# EAGLE design Multimeter1.1 (EAGLE 7.1.0)
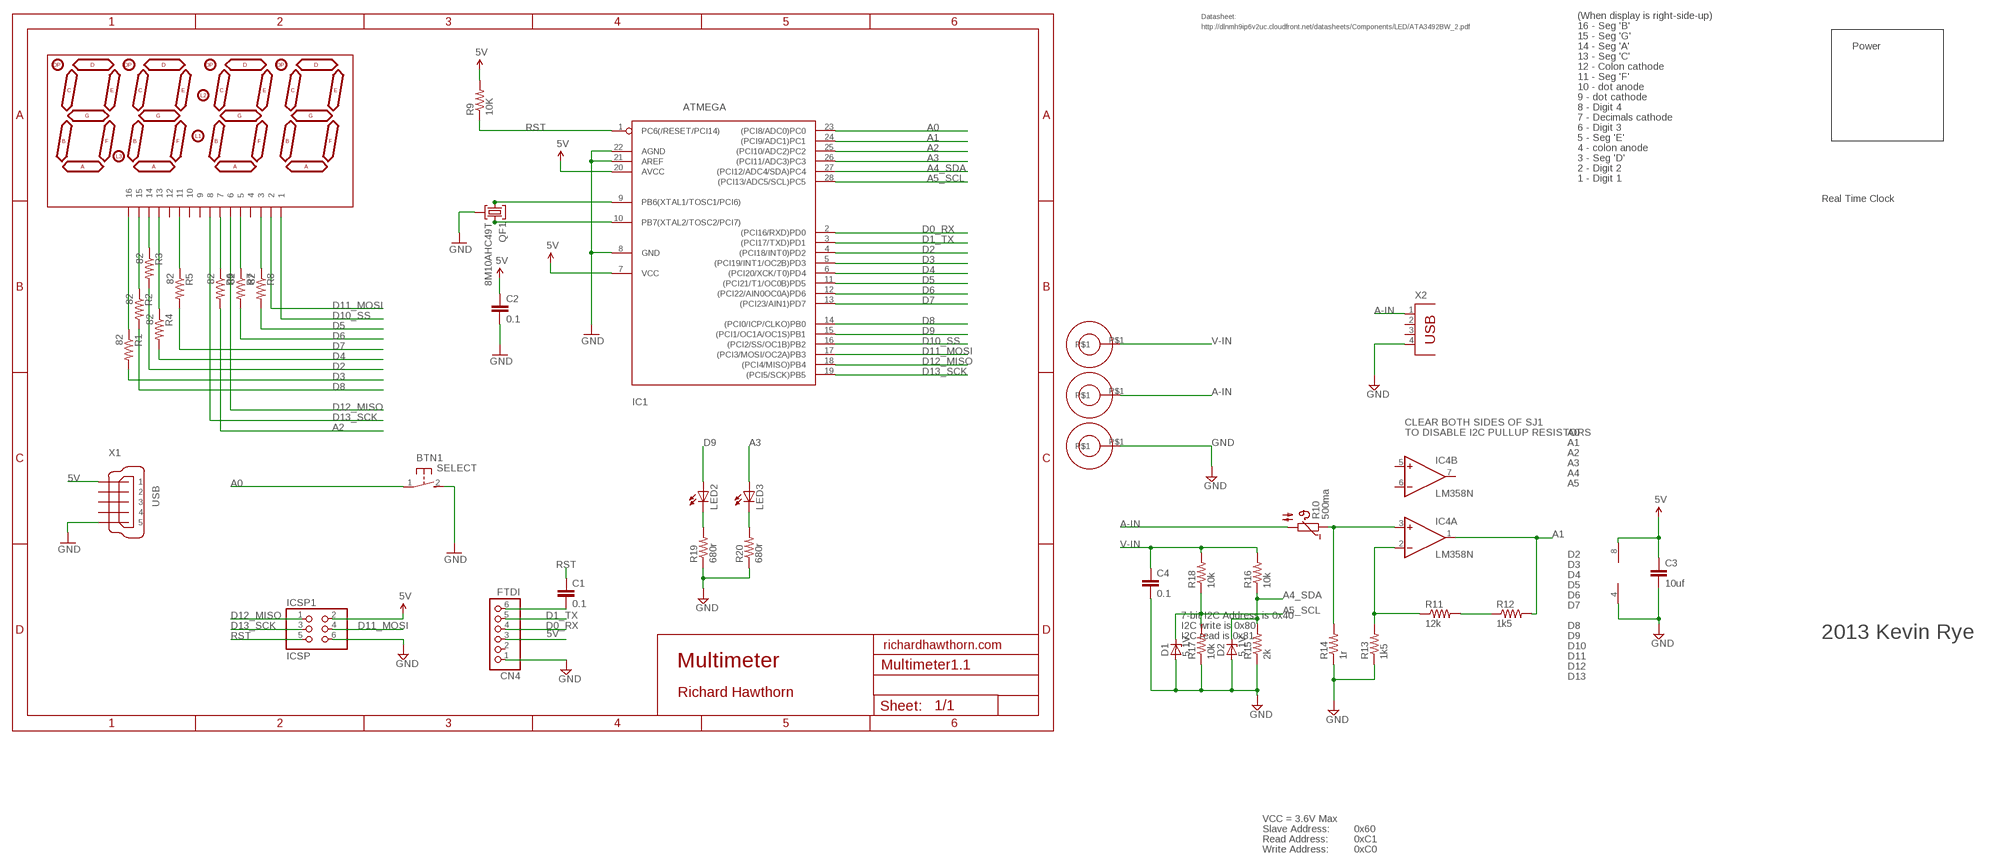
[diagram p0: schematic, sheet 1]

## Parts
BTN1  SELECT  DTS-3  [DTS-3]
C1  0.1  CAPPTH2  [CAP-PTH-SMALL2]
C2  0.1  CAPPTH2  [CAP-PTH-SMALL2]
C3  10uf  CAPPTH2  [CAP-PTH-SMALL2]
C4  0.1  CAPPTH2  [CAP-PTH-SMALL2]
CN4  FTDI  PINHD-1X6  [1X06]
D1  5.1V  BZX90  [DO34Z7]
D2  5.1V  BZX90  [DO34Z7]
IC1  ATMEGA  ATMEGA168PROUND  [DIL28-3-ROUND]
IC4  LM358N  [DIL08]
ICSP1  ICSP  PINHD-2X3  [2X03]
LED1  7SEG-4DIGIT  [SPARKFUN_7-SEGMENT-4DIGIT]
LED2  LED5MM  [LED5MM]
LED3  LED5MM  [LED5MM]
QF1  8M10AHC49T  [HC49U]
R1  82  R-US_0204/7  [0204/7]
R2  82  R-US_0204/7  [0204/7]
R3  82  R-US_0204/7  [0204/7]
R4  82  R-US_0204/7  [0204/7]
R5  82  R-US_0204/7  [0204/7]
R6  82  R-US_0204/7  [0204/7]
R7  82  R-US_0204/7  [0204/7]
R8  82  R-US_0204/7  [0204/7]
R9  10K  R-US_0204/7  [0204/7]
R10  500ma  B57164  [B57164]
R11  12k  R-US_0204/7  [0204/7]
R12  1k5  R-US_0204/7  [0204/7]
R13  1k5  R-US_0204/7  [0204/7]
R14  1r  R-US_0204/7  [0204/7]
R15  2k  R-US_0204/7  [0204/7]
R16  10k  R-US_0204/7  [0204/7]
R17  10k  R-US_0204/7  [0204/7]
R18  10k  R-US_0204/7  [0204/7]
R19  680r  R-US_0204/7  [0204/7]
R20  680r  R-US_0204/7  [0204/7]
U$1  BANANA  [BANANA]
U$5  BANANA  [BANANA]
U$6  BANANA  [BANANA]
X1  USB  MINI-USB_SHIELD5P2-32005-601  [32005-601]
X2  PN87520  [PN87520]

## Nets
5V [power]: C2.1 C3.1 CN4.3 IC1.7(VCC) IC1.20(AVCC) IC4.8(P:V+) ICSP1.2 R9.2 X1.1
A0: BTN1.1 IC1.23((PCI8/ADC0)PC0)
A1: IC1.24((PCI9/ADC1)PC1) IC4.1(A:OUT) R12.2
A2: IC1.25((PCI10/ADC2)PC2) R6.2
A3: IC1.26((PCI11/ADC3)PC3) LED3.A
A4_SDA: D2.C IC1.27((PCI12/ADC4/SDA)PC4) R15.2 R16.1
A5_SCL [power]: D1.C IC1.28((PCI13/ADC5/SCL)PC5) R17.2 R18.1
A-IN [power]: R10.2 U$5.P$1 X2.1
D0_RX: CN4.4 IC1.2((PCI16/RXD)PD0)
D1_TX: CN4.5 IC1.3((PCI17/TXD)PD1)
D2: IC1.4((PCI18/INT0)PD2) R3.2
D3: IC1.5((PCI19/INT1/OC2B)PD3) R1.2
D4: IC1.6((PCI20/XCK/T0)PD4) R4.2
D5: IC1.11((PCI21/T1/OC0B)PD5) R8.2
D6: IC1.12((PCI22/AIN0OC0A)PD6) R7.2
D7: IC1.13((PCI23/AIN1)PD7) R5.2
D8: IC1.14((PCI0/ICP/CLKO)PB0) R2.2
D9: IC1.15((PCI1/OC1A/OC1S)PB1) LED2.A
D10_SS: IC1.16((PCI2/SS/OC1B)PB2) LED1.1
D11_MOSI: IC1.17((PCI3/MOSI/OC2A)PB3) ICSP1.4 LED1.2
D12_MISO: IC1.18((PCI4/MISO)PB4) ICSP1.1 LED1.6
D13_SCK: IC1.19((PCI5/SCK)PB5) ICSP1.3 LED1.8
GND [power]: BTN1.2 C2.2 C3.2 C4.2 CN4.1 D1.A D2.A IC1.8(GND) IC1.21(AREF) IC1.22(AGND) IC4.4(P:V-) ICSP1.6 QF1.2 R13.1 R14.1 R15.1 R17.1 R19.1 R20.1 U$6.P$1 X1.5 X2.4
N$3: LED1.16 R1.1
N$4: IC4.2(A:-IN) R11.1 R13.2
N$5: LED1.15 R2.1
N$7: LED2.K(C) R19.2
N$8: LED3.K(C) R20.2
N$10: R11.2 R12.1
N$12: LED1.7 R6.1
N$13 [power]: IC4.3(A:+IN) R10.1 R14.2
N$16: IC1.9(PB6(XTAL1/TOSC1/PCI6)) QF1.1
N$20: C1.2 CN4.6
N$22: LED1.13 R4.1
N$24: LED1.14 R3.1
N$25: LED1.11 R5.1
N$26: IC1.10(PB7(XTAL2/TOSC2/PCI7)) QF1.3
N$29: LED1.5 R7.1
N$30: LED1.3 R8.1
RST: C1.1 IC1.1(PC6(/RESET/PCI14)) ICSP1.5 R9.1
V-IN [power]: C4.1 R16.2 R18.2 U$1.P$1
Unconnected: CN4.2 IC4.5(B:+IN) IC4.6(B:-IN) IC4.7(B:OUT) LED1.4 LED1.9 LED1.10 LED1.12 X1.2 X1.3 X1.4 X1.M1(S1) X1.M2(S2) X2.2 X2.3

## Notes on the sheet
- Datasheet: | (When display is right-side-up)
- http://dlnmh9ip6v2uc.cloudfront.net/datasheets/Components/LED/ATA3492BW_2.pdf | 16 - Seg 'B'
- 15 - Seg 'G'
- 14 - Seg 'A' | Power
- 13 - Seg 'C'
- 12 - Colon cathode
- 11 - Seg 'F'
- 10 - dot anode
- 9 - dot cathode
- 8 - Digit 4
- 7 - Decimals cathode
- 6 - Digit 3
- 5 - Seg 'E'
- 4 - colon anode
- 3 - Seg 'D'
- 2 - Digit 2
- 1 - Digit 1
- Real Time Clock
- CLEAR BOTH SIDES OF SJ1
- TO DISABLE I2C PULLUP RESISTORS | A0
- A1
- A2
- A3
- A4
- A5
- D2
- D3
- D4
- D5
- D6
- D7
- 7-bit I2C Address is 0x40
- I2C write is 0x80 | D8
- I2C read is 0x81 | D9 | 2013 Kevin Rye
- richardhawthorn.com | D10
- D11
- Multimeter | D12
- D13
- Richard Hawthorn
- VCC = 3.6V Max
- Slave Address: | 0x60
- Read Address: | 0xC1
- Write Address: | 0xC0

## Library data of the parts
BTN1 = switch-tact:DTS-3
C1-C4 = LowPowerLab:CAP: Capacitor Standard 0603 ceramic capacitor, and 0.1" leaded capacitor.
CN4 = pinhead:PINHD-1X6: PIN HEADER
D1 D2 = diode:BZX90: Z DIODE
IC1 = adafruit:ATMEGA168*P: MICROCONTROLLER 16 kBytes FLASH 1 kBytes SRAM 512 Bytes EEPROM USART 8-channel 10 bit ADC
IC4 = linear:LM358: OP AMP also LM158; LM258; LM2904 Source: http://cache.national.com/ds/LM/LM158.pdf
ICSP1 = pinhead:PINHD-2X3: PIN HEADER
LED1 = sparkfun-4digit-sseg:7SEG-4DIGIT
LED2 LED3 = led:LED: LED OSRAM: - CHIPLED LG R971, LG N971, LY N971, LG Q971, LY Q971, LO R971, LY R971 LH N974, LH R974 LS Q976, LO Q976, LY Q976 LO Q996 - Hyper CHIPLED LW Q18S LB Q993, LB Q99A, LB R99A - SideLED LS A670, LO A670, LY A670, LG A670, LP A670 LB A673, LV A673, LT A673, LW A673 LH A674 LY A675 LS A676, LA A676, LO A676, LY A676, LW A676 LS A679, LY A679, LG A679 - Hyper Micro SIDELED® LS Y876, LA Y876, LO Y876, LY Y876 LT Y87S - SmartLED LW L88C, LW L88S LB L89C, LB L89S, LG L890 LS L89K, LO L89K, LY L89K LS L896, LA L896, LO L896, LY L896 - TOPLED LS T670, LO T670, LY T670, LG T670, LP T670 LSG T670, LSP T670, LSY T670, LOP T670, LYG T670 LG T671, LOG T671, LSG T671 LB T673, LV T673, LT T673, LW T673 LH T674 LS T676, LA T676, LO T676, LY T676, LB T676, LH T676, LSB T676, LW T676 LB T67C, LV T67C, LT T67C, LS T67K, LO T67K, LY T67K, LW E67C LS E67B, LA E67B, LO E67B, LY E67B, LB E67C, LV E67C, LT E67C LW T67C LS T679, LY T679, LG T679 LS T770, LO T770, LY T770, LG T770, LP T770 LB T773, LV T773, LT T773, LW T773 LH T774 LS E675, LA E675, LY E675, LS T675 LS T776, LA T776, LO T776, LY T776, LB T776 LHGB T686 LT T68C, LB T68C - Hyper Mini TOPLED® LB M676 - Mini TOPLED Santana® LG M470 LS M47K, LO M47K, LY M47K Source: http://www.osram.convergy.de LUXEON: - LUMILED® LXK2-PW12-R00, LXK2-PW12-S00, LXK2-PW14-U00, LXK2-PW14-V00 LXK2-PM12-R00, LXK2-PM12-S00, LXK2-PM14-U00 LXK2-PE12-Q00, LXK2-PE12-R00, LXK2-PE12-S00, LXK2-PE14-T00, LXK2-PE14-U00 LXK2-PB12-K00, LXK2-PB12-L00, LXK2-PB12-M00, LXK2-PB14-N00, LXK2-PB14-P00, LXK2-PB14-Q00 LXK2-PR12-L00, LXK2-PR12-M00, LXK2-PR14-Q00, LXK2-PR14-R00 LXK2-PD12-Q00, LXK2-PD12-R00, LXK2-PD12-S00 LXK2-PH12-R00, LXK2-PH12-S00 LXK2-PL12-P00, LXK2-PL12-Q00, LXK2-PL12-R00 Source: www.luxeon.com KINGBRIGHT: KA-3528ASYC Source: www.kingbright.com
QF1 = crystal:8M10AHC49T: Monolithic Crystal Filters Source: www.vanlong.com; OC_FARNELL: unknown; OC_NEWARK: unknown
R1-R9 R11-R20 = adafruit:R-US_: RESISTOR, American symbol
R10 = ptc-ntc:B57164: SIEMENS NTC; MPN: B57164K474K52; OC_FARNELL: 9753451; OC_NEWARK: 29M3118
U$1 U$5 U$6 = Richards:BANANA
X1 = con-cypressindustries:MINI-USB_SHIELD5P2-: MINI USB-B R/A DIP 5pol. Source: www.cypressindustries.com; OC_FARNELL: unknown; OC_NEWARK: unknown
X2 = con-berg:PN87520: BERG USB connector; OC_FARNELL: unknown; OC_NEWARK: unknown

## Net classes
1 power: width 0.635 mm, clearance 0.254 mm

## Board
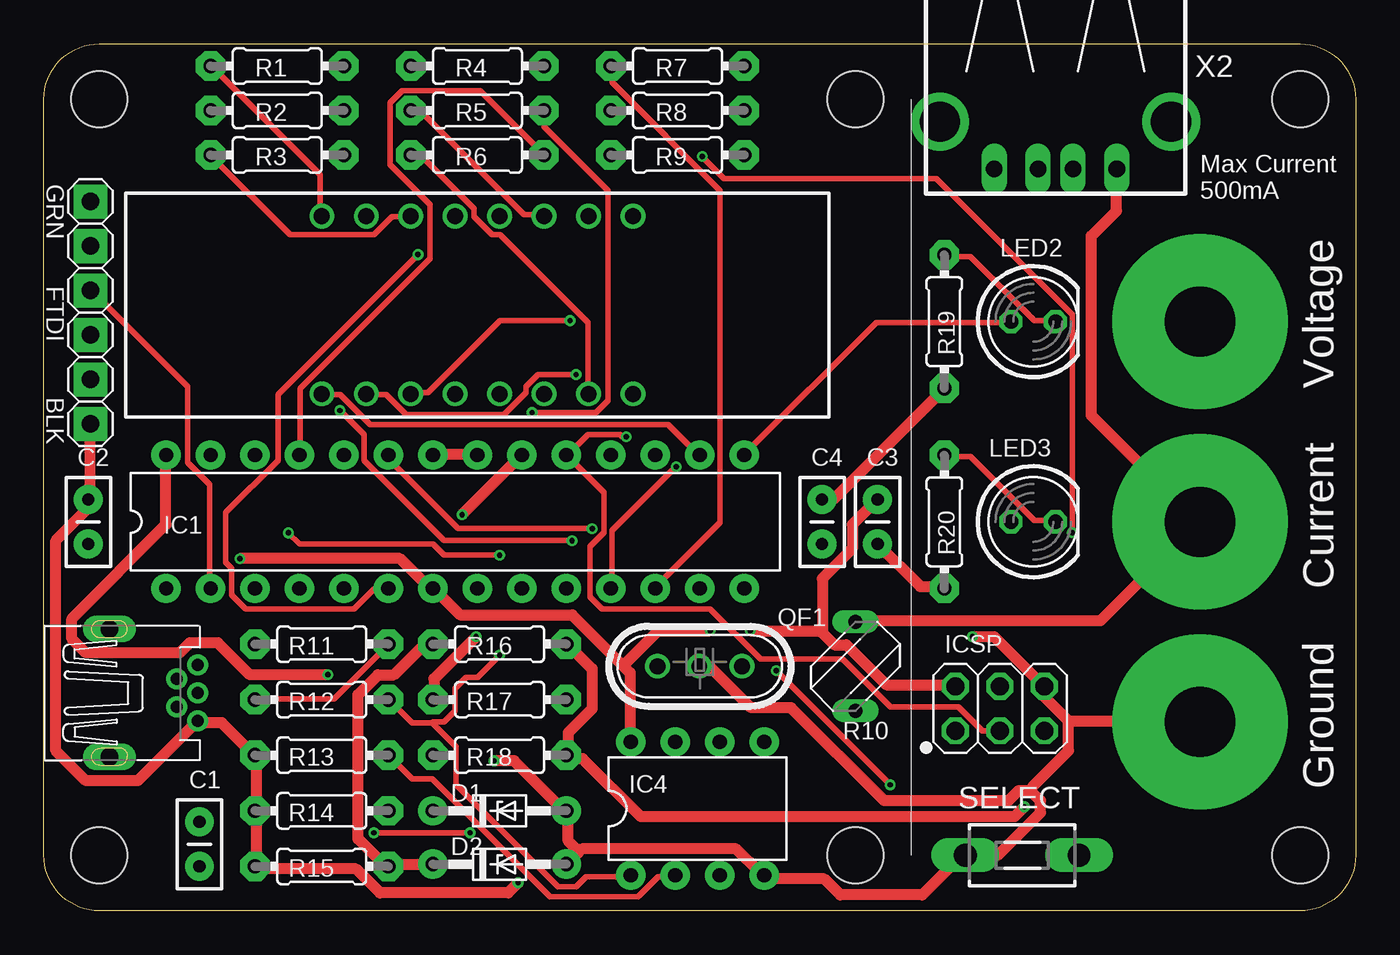
[diagram p1: board, top side]
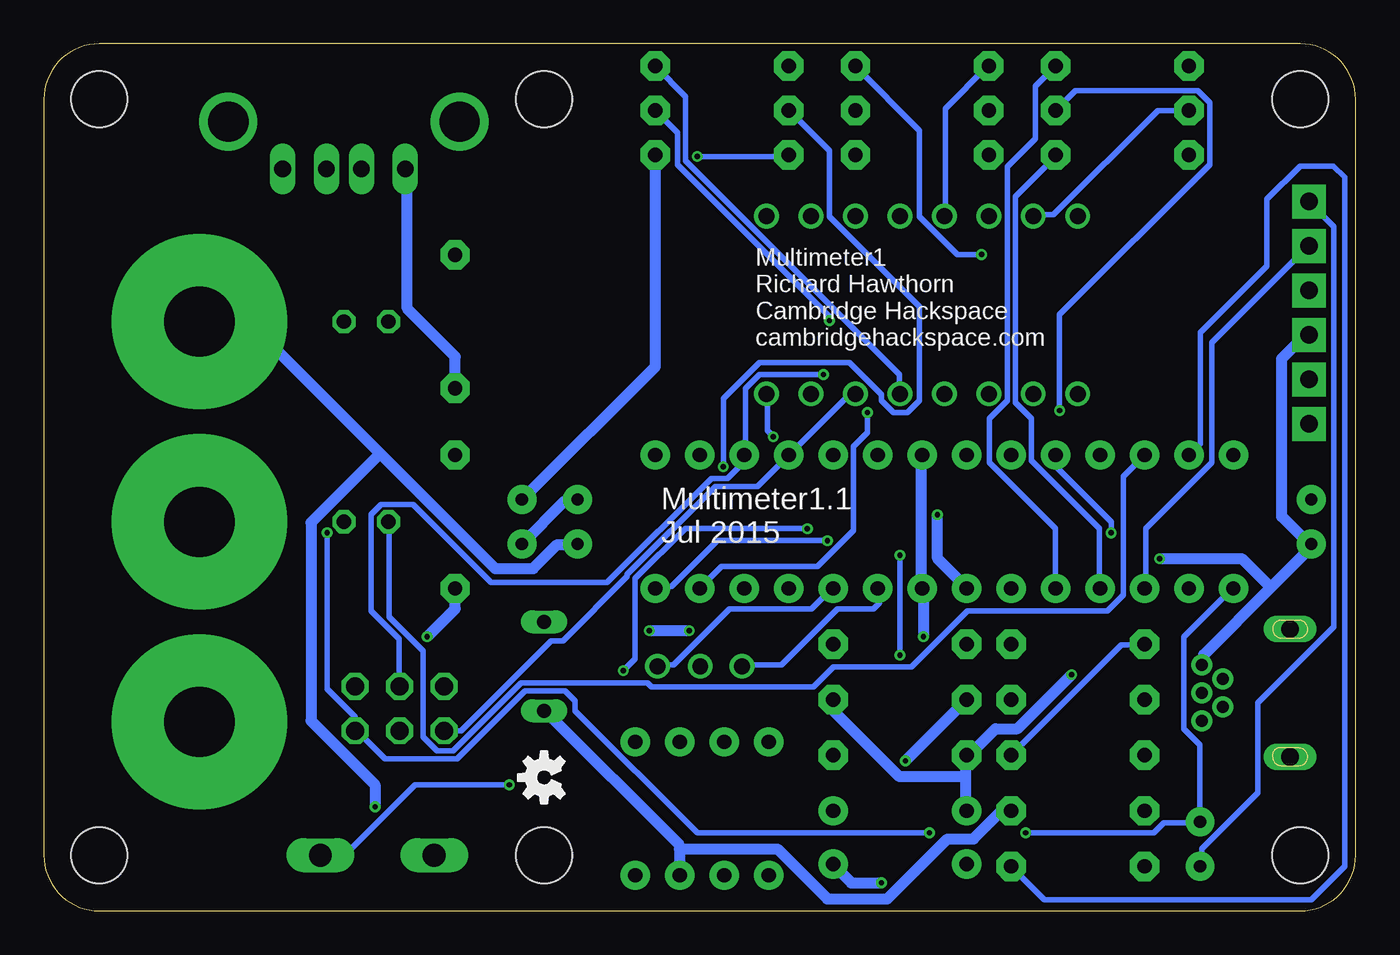
[diagram p2: board, bottom side, seen from below]

Size 74.93 x 49.53 mm. Coordinates in mm from the lower left corner, seen from the top.
Outline: 46.35,49.53 3.17,49.53 arc90 0,46.35 0,3.17 arc90 3.17,0 46.35,0
Outline: 34.29,49.53 71.75,49.53 arc-90 74.93,46.35 74.93,3.17 arc-90 71.75,0 27.94,0
Copper layers (1*16): Top 0.035mm / dielectric 1.5mm / Bottom 0.035mm
Design rules "ITEADstudio_DRC *": minimum track width 12mil, minimum drill 12mil, track to track 6mil, track to pad 6mil, pad to pad 6mil, via to via 6mil, smd to smd 0mil, copper to edge 10mil, drill to drill 10mil, minimum pad ring 10mil, minimum via ring 6mil, stop-mask expansion 2mil, vias tented up to drill 100mil, thermal gap 15mil
Holes 3.2 mm at 3.17,3.17 46.35,3.17 3.17,46.35 46.35,46.35 71.75,46.35 71.75,3.17
tKeepout: area 0,0 to 5.7,5.7; area 0,43.8 to 5.7,49.5; area 69.2,43.8 to 74.9,49.5; area 69.2,0 to 74.9,5.7
bKeepout: area 0,43.8 to 5.7,49.5; area 0,0 to 5.7,5.7; area 69.2,43.8 to 74.9,49.5; area 69.2,0 to 74.9,5.7
tRestrict: area 24.3,8.9 to 29.1,12.8; area 5.8,16.9 to 6.9,18.5; area 5.2,9.7 to 6.7,10.4
bRestrict: area 27.4,17.7 to 29.2,18.7; area 21.1,13.8 to 22.9,14.9; area 21.6,12.6 to 22.1,13.2; area 20.7,12.6 to 21.2,13.2; area 20.2,12.8 to 20.7,13.5; area 20.1,13.4 to 20.6,14; area 26.5,18.9 to 27.1,19.5; area 26.5,17.9 to 27.1,18.5; area 27.5,19.1 to 28,19.8; area 27.9,18.8 to 29.1,19.6

### Footprints (pad centres in the part's own frame; a part is rotated, then mirrored left to right if it is on the bottom)
DTS-3 = drill 1.3 long: 1 -3.25,0; 2 3.25,0
CAP-PTH-SMALL2 = drill 0.7 pad 1.651: 1 0,0; 2 2.54,0
1X06 = drill 1 pad 1.93 square: 1 -6.35,0; 2 -3.81,0; 3 -1.27,0; 4 1.27,0; 5 3.81,0; 6 6.35,0
DO34Z7 = drill 0.813 pad 1.676: A 3.81,0; C -3.81,0
DIL28-3-ROUND = drill 0.813 pad 1.676: 1 -16.51,-3.81; 2 -13.97,-3.81; 3 -11.43,-3.81; 4 -8.89,-3.81; 5 -6.35,-3.81; 6 -3.81,-3.81; 7 -1.27,-3.81; 8 1.27,-3.81; 9 3.81,-3.81; 10 6.35,-3.81; 11 8.89,-3.81; 12 11.43,-3.81; 13 13.97,-3.81; 14 16.51,-3.81; 15 16.51,3.81; 16 13.97,3.81; 17 11.43,3.81; 18 8.89,3.81; 19 6.35,3.81; 20 3.81,3.81; 21 1.27,3.81; 22 -1.27,3.81; 23 -3.81,3.81; 24 -6.35,3.81; 25 -8.89,3.81; 26 -11.43,3.81; 27 -13.97,3.81; 28 -16.51,3.81
DIL08 = drill 0.813 pad 1.676: 1 -3.81,-3.81; 2 -1.27,-3.81; 3 1.27,-3.81; 4 3.81,-3.81; 5 3.81,3.81; 6 1.27,3.81; 7 -1.27,3.81; 8 -3.81,3.81
2X03 = drill 1.016 octagon: 1 -2.54,-1.27; 2 -2.54,1.27; 3 0,-1.27; 4 0,1.27; 5 2.54,-1.27; 6 2.54,1.27
SPARKFUN_7-SEGMENT-4DIGIT = drill 0.9: 1 -8.89,-5.08; 2 -6.35,-5.08; 3 -3.81,-5.08; 4 -1.27,-5.08; 5 1.27,-5.08; 6 3.81,-5.08; 7 6.35,-5.08; 8 8.89,-5.08; 9 8.89,5.08; 10 6.35,5.08; 11 3.81,5.08; 12 1.27,5.08; 13 -1.27,5.08; 14 -3.81,5.08; 15 -6.35,5.08; 16 -8.89,5.08
LED5MM = drill 0.813 octagon: A -1.27,0; K 1.27,0
HC49U = drill 0.9: 1 -2.413,0; 2 -0.027,0; 3 2.413,0
0204/7 = drill 0.813 pad 1.676 octagon: 1 -3.81,0; 2 3.81,0
B57164 = drill 0.813 long: 1 -2.54,0; 2 2.54,0
BANANA = drill 4 pad 10: P$1 0,0
32005-601 = drill 0.7 pad 1.016: 1 2.825,1.6; 2 1.625,0.8; 3 2.825,0; 4 1.625,-0.8; 5 2.825,-1.6 | drill 1 pad 1.422 long: M1 -2.225,3.65; M2 -2.225,-3.65
PN87520 = drill 0.95 long: 1 -3.5,2.71; 2 -1,2.71; 3 1,2.71; 4 3.5,2.71 | drill 2.3: P$1 -6.604,0; P$2 6.604,0

### Placement (x,y rotation side)
BTN1  55.88,3.17 180 top
C1  8.89,5.08 270 top
C2  2.54,20.95 90 top
C3  47.62,23.5 270 top
C4  44.45,20.95 90 top
CN4  2.67,34.16 90 top
D1  26.04,5.71 0 top
D2  26.04,2.67 0 top
IC1  23.5,22.23 0 top
IC4  37.34,5.84 0 top
ICSP1  54.61,11.56 0 top
LED1  24.77,34.61 0 top
LED2  56.52,33.66 0 top
LED3  56.52,22.23 0 top
QF1  37.47,13.97 0 top
R1  13.34,48.26 0 top
R2  13.34,45.72 0 top
R3  13.34,43.18 0 top
R4  24.77,48.26 0 top
R5  24.77,45.72 0 top
R6  24.77,43.18 0 top
R7  36.2,48.26 180 top
R8  36.2,45.72 180 top
R9  36.2,43.18 0 top
R10  46.35,13.97 90 top
R11  15.88,15.24 0 top
R12  15.88,12.06 0 top
R13  15.88,8.89 0 top
R14  15.88,5.71 0 top
R15  15.88,2.54 0 top
R16  26.04,15.24 0 top
R17  26.04,12.06 0 top
R18  26.04,8.89 0 top
R19  51.44,33.66 90 top
R20  51.44,22.23 90 top
U$1  66.04,33.66 0 top
U$3  [OSHW-LOGO-S]  46.35,7.62 90 bottom
U$5  66.04,22.23 0 top
U$6  66.04,10.79 0 top
X1  5.97,12.45 0 top
X2  57.78,45.09 180 top

### Tracks (layer width: path | path; a pad name or v marks a point on that pad's centre or on a via)
5V  (via drill 0.3)
  Top 0.635: 44.46,15.89 45.15,15.2 45.83,15.2 48.12,12.92 52.01,12.92 ICSP1.2 | 44.46,15.89 44.46,18.97 46.18,20.69 46.18,22.06 47.55,23.43 C3.1 | 33.09,14 30.18,16.92 23.77,16.92 22.29,18.4 IC1.7 21.95,18.52 20.34,20.12 v11.2,20.12 | 33.09,14 33.49,13.6 33.49,9.72 IC4.8 | v23.89,22.63 27.2,25.95 IC1.20 | v40.35,16 44.23,16 44.46,15.89 | v38.06,16 35.09,16 33.09,14
  Bottom 0.635: R9.2 40.01,31.09 47.55,23.55 C3.1 | 4.86,18.46 2.63,20.69 2.63,20.92 C2.1 2.86,21.14 4.23,22.52 4.23,31.55 2.97,32.8 2.74,32.8 CN4.3 | 4.86,18.46 8.69,14.63 8.69,14.06 X1.1 | 26.98,26.06 27.2,26.06 IC1.20 | v23.89,22.63 23.89,20.12 22.29,18.52 IC1.7 | 4.86,18.46 6.51,20.12 v11.2,20.12 | v38.06,16 v40.35,16
A0  (via drill 0.3)
  Top 0.305: v31.32,21.83 23.66,21.83 19.77,25.72 19.77,25.95 IC1.23 | v48.35,7.2 v41.83,13.72
  Bottom 0.305: v31.32,21.83 38.29,21.83 41.15,18.97 41.15,14.4 v41.83,13.72 | v48.35,7.2 53.72,7.2 57.72,3.2 59.09,3.2 BTN1.1
A1  (via drill 0.3)
  Top 0.305: 22.17,10.74 23.55,9.37 23.55,7.2 29.38,1.37 30.4,1.37 30.98,1.94 33.49,1.94 IC4.1 | 22.17,10.74 21.03,10.74 19.77,12 R12.2 | v13.97,21.59 14.61,20.95 22.23,20.95 22.86,20.32 v26.04,20.32 | v26.04,14.61 24.77,13.34 24.13,13.34 23.5,12.7 23.5,11.43 22.86,10.79 22.23,10.79 22.17,10.74
  Bottom 0.305: IC1.24 17.14,25.4 13.97,22.23 v13.97,21.59 | v26.04,14.61 v26.04,20.32
A2
  Top 0.305: IC1.25 14.63,26.06 14.63,29.83 22.06,37.26 22.06,40.35 19.77,42.63 19.77,46.18 20.46,46.86 24.92,46.86 28.57,43.2 R6.2
A3
  Bottom 0.305: LED3.A 55.21,22.17 55.21,16.8 53.26,14.86 53.26,9.94 52.46,9.14 51.55,9.14 47.66,13.03 40.46,13.03 40.23,12.8 30.98,12.8 29.83,13.95 25.38,13.95 22.17,17.14 14.17,17.14 13.26,18.06 13.26,24.8 12.12,25.95 IC1.26
A4_SDA
  Top 0.635: D2.C 22.17,2.63 19.77,2.63 R15.2 19.43,2.63 17.95,4.12 17.95,12.34 19.09,13.49 20,13.49 21.72,15.2 22.17,15.2 R16.1
  Bottom 0.305: IC1.27 8.89,26.67 8.89,33.02 5.08,36.83 5.08,40.64 3.17,42.55 1.27,42.55 0.64,41.91 0.64,2.54 2.54,0.64 17.78,0.64 R15.2
A5_SCL  (via drill 0.3)
  Top 0.635: v16.23,13.49 11.77,13.49 9.94,15.32 8.34,15.32 7.77,14.74 2.4,14.74 1.6,15.54 1.6,16.69 6.97,22.06 6.97,25.95 IC1.28
  Bottom 0.635: 22.29,7.66 22.29,8.8 R18.1 21.95,9.03 20.57,10.4 19.32,10.4 v16.23,13.49 | 22.29,7.66 22.29,5.71 D1.C | 22.29,7.66 26.06,7.66 29.83,11.43 29.83,12 R17.2
A-IN
  Top 0.635: R10.2 46.41,16.57 60.35,16.57 65.95,22.17 U$5.P$1 65.72,22.4 59.83,28.3 59.83,38.54 61.27,39.98 61.27,42.29 X2.1
D0_RX
  Top 0.305: IC1.2 9.49,18.52 9.49,24.35 8.23,25.6 8.23,29.95 2.74,35.43 CN4.4
D1_TX
  Bottom 0.305: IC1.3 12,18.52 12,21.83 8.23,25.6 8.23,32.46 2.74,37.95 CN4.5
D2
  Bottom 0.305: IC1.4 14.63,18.52 14.63,21.83 18.52,25.72 18.52,28.12 19.43,29.03 19.43,40.8 17.14,43.09 R3.2
D3
  Bottom 0.305: IC1.5 17.14,21.83 20.92,25.6 20.92,28.12 19.89,29.15 19.89,42.52 18.29,44.12 18.29,47.09 17.14,48.23 R1.2
D4  (via drill 0.3)
  Top 0.305: v21.37,37.49 13.37,29.49 13.37,25.72 10.4,22.75 10.4,19.89 10.74,19.55 10.74,18.06 11.54,17.26 17.72,17.26 18.86,18.4 19.66,18.4 IC1.6
  Bottom 0.305: v21.37,37.49 22.75,37.49 24.92,39.66 24.92,44.58 28.57,48.23 R4.2
D5  (via drill 0.3)
  Top 0.305: v36.12,25.38 32.46,21.72 32.46,18.52 IC1.11
  Bottom 0.305: v36.12,25.38 36.12,29.26 34.06,31.32 28.92,31.32 27.09,29.49 27.09,29.15 26.4,28.46 25.6,28.46 24.92,29.15 24.92,34.52 30.06,39.66 30.06,43.43 32.35,45.72 R8.2
D6
  Top 0.305: R7.2 32.46,48.23 32.46,47.32 38.63,41.15 38.63,22.17 34.98,18.52 IC1.12
D7  (via drill 0.3)
  Top 0.305: R5.2 28.57,44.81 32.23,41.15 32.23,29.15 31.55,28.46 v27.89,28.46
  Bottom 0.305: v27.89,28.46 27.89,27.32 28.69,26.52 28.69,21.72 30.75,19.66 36.23,19.66 37.38,18.52 IC1.13
D8  (via drill 0.3)
  Top 0.305: v30.18,21.14 22.86,21.14 18.29,25.72 18.29,27.2 v16.92,28.57
  Bottom 0.305: v30.18,21.14 36.46,21.14 39.09,18.52 40.01,18.52 IC1.14 | v16.92,28.57 16.92,34.06 8.34,42.63 8.34,46.18 9.03,46.86 16,46.86 R2.2
D9
  Top 0.305: LED2.A 55.21,33.6 47.55,33.6 40.01,26.06 IC1.15
D10_SS
  Top 0.305: LED1.1 15.89,29.49 16.92,29.49 18.63,27.77 35.66,27.77 37.38,26.06 IC1.16
D11_MOSI  (via drill 0.3)
  Top 0.305: v30.4,30.63 28.23,30.63 27.55,29.95 27.55,29.6 26.29,28.35 20.69,28.35 19.55,29.49 18.52,29.49 LED1.2
  Bottom 0.305: v30.4,30.63 34.06,30.63 34.86,29.83 34.86,26.06 IC1.17 34.98,25.95 34.98,25.6 35.89,24.69 36.8,24.69 42.75,18.75 49.38,18.75 53.84,23.2 55.66,23.2 56.24,22.63 56.24,17.14 54.63,15.54 54.63,12.92 ICSP1.4
D12_MISO
  Bottom 0.305: LED1.6 28.57,29.49 28.92,29.49 32.35,26.06 IC1.18 32.46,25.95 34.18,24.23 36.58,24.23 41.6,19.2 41.6,19.09 45.26,15.43 45.95,15.43 51.09,10.29 ICSP1.1
D13_SCK  (via drill 0.3)
  Top 0.305: v33.26,27.09 33.03,27.09 32.92,27.2 31.09,27.2 29.95,26.06 IC1.19 29.95,25.95 32,23.89 32,21.6 31.2,20.8 31.2,17.95 31.89,17.26 38.06,17.26 40.92,14.4 45.61,14.4 48.35,11.66 52.23,11.66 53.61,10.29 ICSP1.3
  Bottom 0.305: v33.26,27.09 33.6,27.43 33.6,29.49 LED1.8
GND  (via drill 0.3)
  Top 0.635: CN4.1 2.63,27.77 2.63,23.55 C2.2 2.52,23.2 2.52,22.97 0.69,21.14 0.69,9.14 2.4,7.43 5.37,7.43 8.57,10.63 X1.5 8.8,10.74 10.17,10.74 12,8.91 R13.1 12.12,8.57 12.12,5.94 R14.1 12.12,5.71 12.12,2.63 R15.1 12.34,2.4 17.83,2.4 19.2,1.03 26.52,1.03 v27.09,1.6 | C3.2 50.06,18.52 51.44,18.52 R20.1 | C4.2 44.46,23.55 45.15,23.55 51.44,29.83 R19.1 | IC1.22 22.29,26.06 24.69,26.06 IC1.21 | v24.69,15.66 22.29,13.26 22.29,12.12 R17.1 | 41.15,2.06 IC4.4 | D2.A 29.95,2.74 30.52,3.31 30.47,3.41 | 30.47,3.41 30.4,3.54 29.95,4 29.95,5.71 D1.A 29.6,5.83 26.86,8.57 v25.72,8.57 | 56.35,6.86 55.66,6.86 55.09,6.29 48.01,6.29 42.69,11.61 40.4,11.61 38.06,13.95 37.49,13.95 QF1.2 | 56.35,6.86 56.92,6.29 56.92,5.6 54.52,3.2 52.69,3.2 BTN1.2 52.35,3.09 50.18,0.91 45.49,0.91 44.58,1.83 41.38,1.83 IC4.4 | 58.52,10.86 57.15,12.23 ICSP1.6 56.92,13.03 54.29,15.66 v53.03,15.66 | 58.52,10.86 58.52,9.14 56.46,7.09 56.35,6.86 | 58.52,10.86 65.95,10.86 U$6.P$1 | 30.47,3.41 30.75,3.54 39.55,3.54 40.92,2.17 IC4.4
  Bottom 0.635: C3.2 45.15,23.43 44.46,23.43 C4.2 | R19.1 51.44,31.66 54.18,34.4 54.18,42.29 X2.4 | v24.69,15.66 24.69,18.4 IC1.8 24.8,18.63 24.8,25.95 IC1.21 | v25.72,8.57 R17.1 | R20.1 51.44,17.26 v53.03,15.66 | v27.09,1.6 28.8,1.6 29.83,2.63 D2.A
N$3
  Top 0.305: LED1.16 15.77,39.78 15.77,42.06 9.6,48.23 R1.1
N$4
  Top 0.305: R13.2 21.03,7.54 22.17,7.54 28.92,0.8 33.95,0.8 35.09,1.94 36.01,1.94 IC4.2
  Bottom 0.305: R13.2 13.37,15.2 12.12,15.2 R11.1
N$5
  Bottom 0.305: R2.1 11.32,45.72 17.26,39.78 18.4,39.78 LED1.15
N$7
  Top 0.305: LED2.K 57.72,33.72 56.58,33.72 52.92,37.38 51.44,37.38 R19.2
N$8
  Top 0.305: LED3.K 57.72,22.29 56.58,22.29 52.92,25.95 51.44,25.95 R20.2
N$10
  Top 0.305: R12.1 12.12,12.12 16.57,12.12 19.66,15.2 R11.2
N$12
  Top 0.305: LED1.7 31.09,29.6 31.09,33.6 26.06,38.63 25.6,38.63 24.57,39.66 24.57,40.12 21.6,43.09 21.03,43.09 R6.1
N$13
  Bottom 0.635: 38.63,3.54 38.63,3.77 46.29,11.43 R10.1 | 38.63,3.54 38.63,2.06 IC4.3 | R14.2 20.23,5.71 21.83,4.12 23.32,4.12 26.75,0.69 30.18,0.69 33.03,3.54 38.63,3.54
N$16
  Bottom 0.305: QF1.1 34.98,14.06 32.8,14.06 29.6,17.26 27.55,17.26 27.2,17.6 27.2,18.4 IC1.9
N$20
  Bottom 0.305: C1.2 8.8,2.63 8.8,3.54 5.6,6.74 5.6,11.89 1.26,16.23 1.26,39.09 2.63,40.46 CN4.6
N$22
  Bottom 0.305: LED1.13 23.43,39.78 23.43,45.83 21.03,48.23 R4.1
N$24
  Top 0.305: LED1.14 20.92,39.66 19.89,39.66 18.86,38.63 14.06,38.63 9.6,43.09 R3.1
N$25
  Top 0.305: R5.1 21.49,45.72 27.43,39.78 28.57,39.78 LED1.11
N$26
  Bottom 0.305: QF1.3 39.78,14.06 38.98,14.06 35.78,17.26 31.09,17.26 29.95,18.4 IC1.10
N$29
  Bottom 0.305: LED1.5 26.06,29.6 26.06,30.63 38.29,42.86 38.29,46.52 40.01,48.23 R7.1
N$30  (via drill 0.3)
  Top 0.305: v30.06,33.72 26.06,33.72 21.95,29.6 21.03,29.6 LED1.3
  Bottom 0.305: v30.06,33.72 30.06,33.95 38.75,42.63 38.75,44.46 R8.1
RST  (via drill 0.3)
  Top 0.305: v58.75,21.6 58.75,34.06 50.98,41.83 38.86,41.83 v37.6,43.09 | v24.35,4.46 v18.86,4.46
  Bottom 0.305: IC1.1 7.09,18.4 9.83,15.66 9.83,10.4 8.91,9.49 8.91,5.14 C1.1 9.03,5.03 10.97,5.03 11.54,4.46 v18.86,4.46 | v58.75,21.6 58.75,12.69 57.15,11.09 ICSP1.5 57.04,10.29 55.44,8.69 51.32,8.69 47.43,12.57 45.15,12.57 44.58,12 44.58,11.43 37.6,4.46 v24.35,4.46 | v37.6,43.09 32.46,43.09 R9.1
V-IN  (via drill 0.3)
  Top 0.635: R16.2 29.95,15.2 31.32,13.83 31.32,11.54 29.95,10.17 29.95,8.91 R18.2 30.18,8.69 30.79,8.69 34.1,5.37 55.44,5.37 v56.01,5.94
  Bottom 0.635: 55.72,26.12 63.21,33.6 65.95,33.6 U$1.P$1 | 55.72,26.12 49.15,19.55 46.98,19.55 45.61,20.92 44.46,20.92 C4.1 | v56.01,5.94 56.01,7.2 59.66,10.86 59.66,22.17 55.72,26.12

### Text on the board
tNames: GRN | Max Current / 500mA | FTDI | Voltage | BLK | Current | Ground
bNames: Multimeter1 / Richard Hawthorn / Cambridge Hackspace / cambridgehackspace.com | Multimeter1.1 / Jul 2015
tDocu: REG